# Altium schematic sheet FlipFlop.SchDoc
size 254 x 177 mm; SheetNumber: 2; SheetTotal: 2
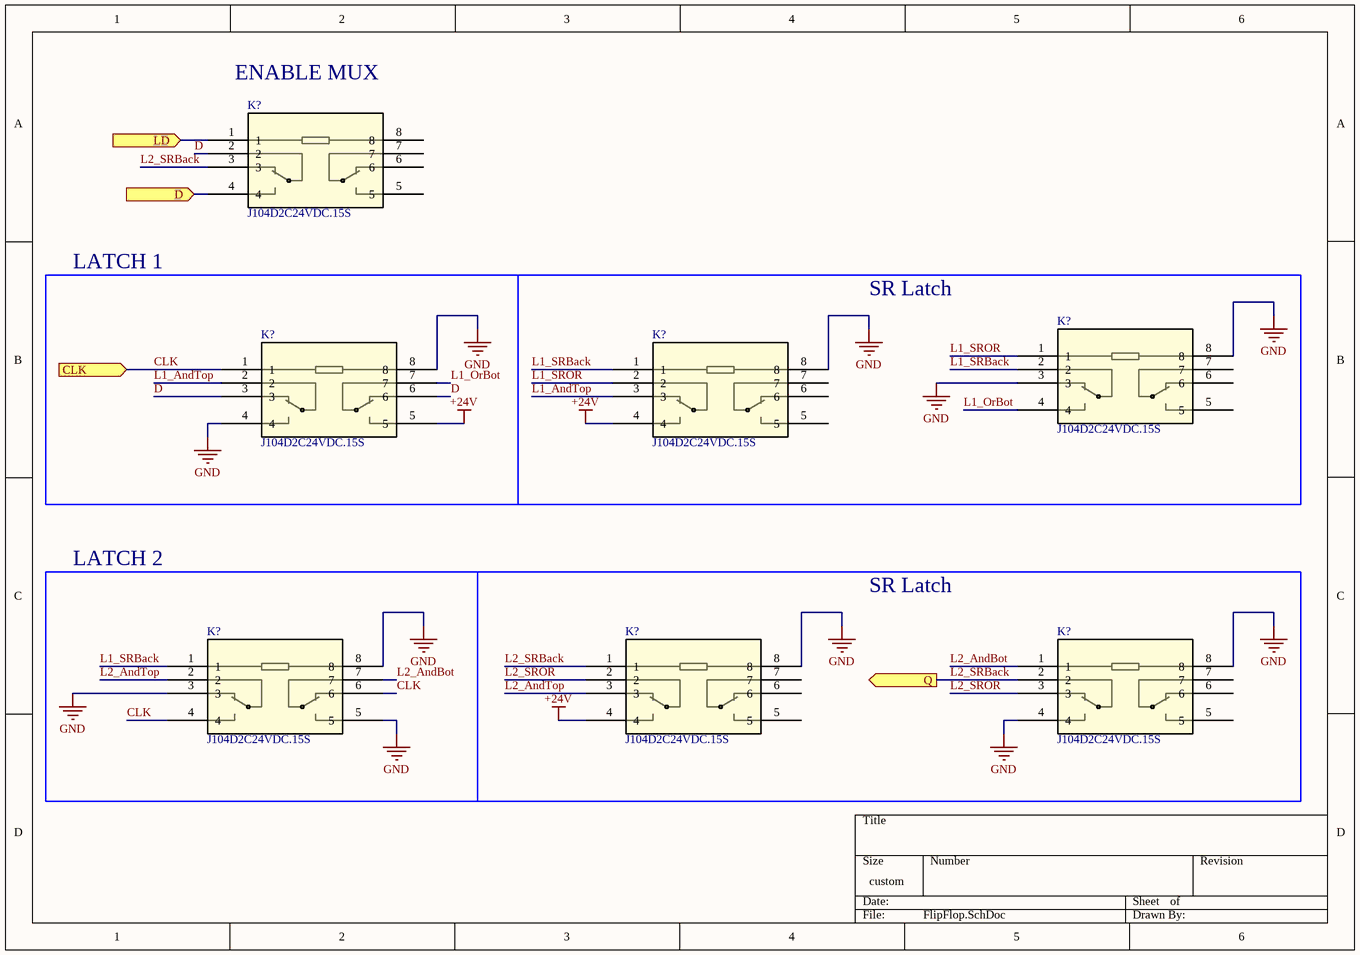
[diagram p0: FlipFlop.SchDoc]

## Parts
(Parts that share a designator on the sheet are numbered #1, #2 ... from top to bottom, then left to right.)
K?#1  J104D2C24VDC.15S  [Relay J104D2C24VDC.15S]
K?#2  J104D2C24VDC.15S  [Relay J104D2C24VDC.15S]
K?#3  J104D2C24VDC.15S  [Relay J104D2C24VDC.15S]
K?#4  J104D2C24VDC.15S  [Relay J104D2C24VDC.15S]
K?#5  J104D2C24VDC.15S  [Relay J104D2C24VDC.15S]
K?#6  J104D2C24VDC.15S  [Relay J104D2C24VDC.15S]
K?#7  J104D2C24VDC.15S  [Relay J104D2C24VDC.15S]

## Ports
CLK (in), D (in), LD (in), Q (out)

## Nets
+24V: K?#3.5 K?#4.4 K?#6.4
GND: K?#2.3 K?#2.8 K?#3.4 K?#3.8 K?#4.8 K?#5.3 K?#5.5 K?#5.8 K?#6.8 K?#7.4 K?#7.8
CLK: K?#3.1 K?#5.4 K?#5.6 ; port CLK
D: K?#1.2 K?#3.3 K?#3.6
D: K?#1.4 ; port D  [a separate net that carries the same name]
L1_AndTop: K?#3.2 K?#4.3
L1_OrBot: K?#2.4 K?#3.7
L1_SRBack: K?#2.2 K?#4.1 K?#5.1
L1_SROR: K?#2.1 K?#4.2
L2_AndBot: K?#5.7 K?#7.1
L2_AndTop: K?#5.2 K?#6.3
L2_SRBack: K?#1.3 K?#6.1 K?#7.2 ; port Q
L2_SROR: K?#6.2 K?#7.3
LD: K?#1.1 ; port LD

Not connected (* = marked no-connect by the designer): K?#1 5 6 7 8; K?#2 5 6 7; K?#4 5 6 7; K?#6 5 6 7; K?#7 5 6 7

## Notes on the sheet
- ENABLE MUX
- LATCH 1
- SR Latch
- LATCH 2

## Library data of the parts
K?#1-K?#7 = Relay J104D2C24VDC.15S: Relay Ul Gen Purp DPDT 2C 24VDC; Manufacturer: CIT Relay & Switch; Coil Current: 6mA; Coil Power: 150mW; Coil Resistance: 3.84kΩ; Coil Voltage (DC): 18V; Contact Current Rating: 2A; Contact Resistance: 50mΩ; Contact Voltage Rating (AC): 250V; Electrical Life: 100kcycles; Insulation Resistance: 100MΩ; Max Voltage Rating (DC): 100V; Release Time: 4ms; Response Time: 6ms; Supplier: DigiKey; Supplier Part Number: 2449-J104D2C24VDC.15S-ND; Manufacturer Part Number: J104D2C24VDC.15S; Category: Signal Relays; Stock: 5620; Pricing: 1=1.26, 20=1.082, 40=1.045, 60=1.02383, 100=0.998, 260=0.95115, 500=0.92036, 1000=0.88878, 5000=0.8195 (USD); Contact Plating: Gold; Height: 11.42mm; Length: 20.37mm; Max Current Rating: 2A; Max Operating Temperature: 85°C; Min Operating Temperature: -40°C; Number of Terminals: 8; Throw Configuration: DPDT